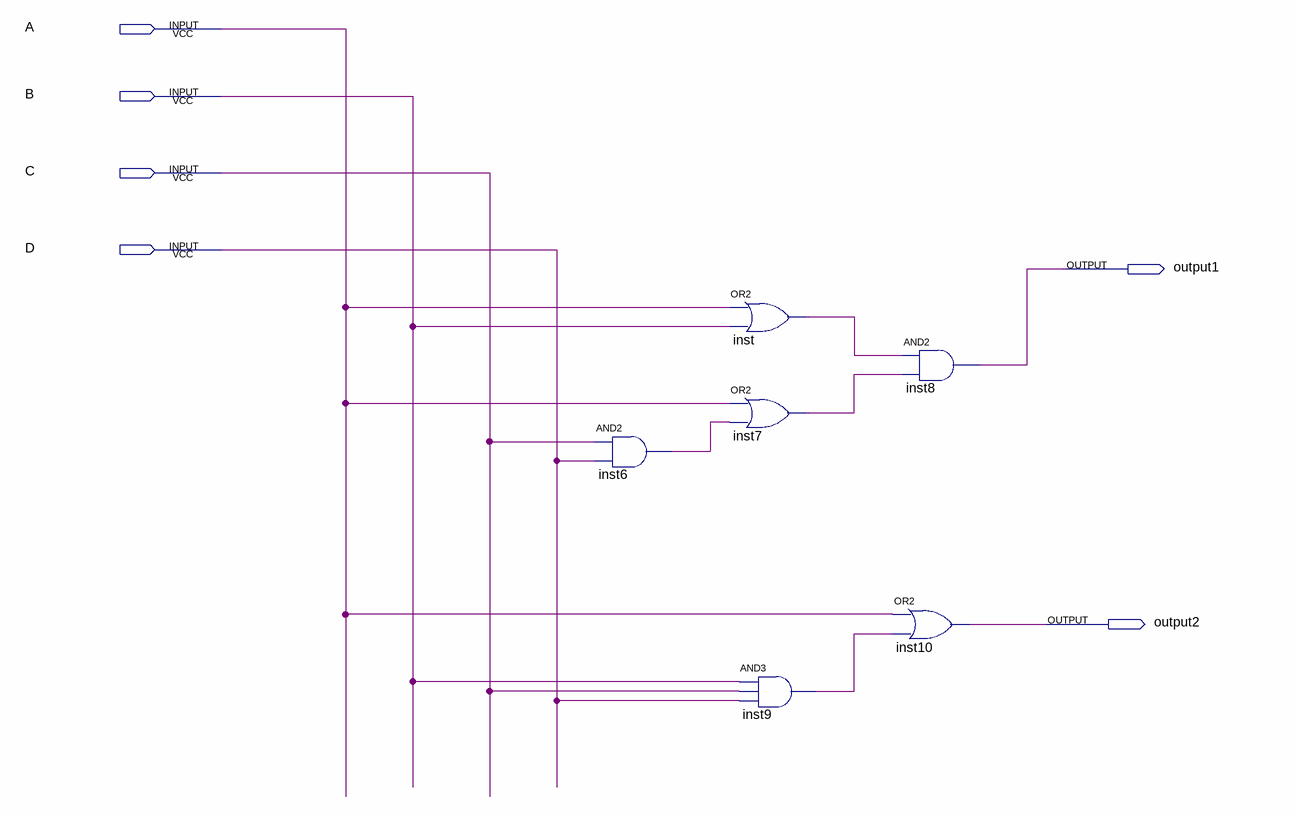
[diagram p0: schematic sheet]
// Quartus schematic work1.bdf as structural Verilog: 6 symbols, 6 pins
module work1 (
  input  A,
  input  B,
  input  C,
  input  D,
  output output1,
  output output2
);

  wire inst6_out, inst7_out, inst9_out, inst_out;

  and inst6 (inst6_out, C, D);
  or inst (inst_out, A, B);
  or inst7 (inst7_out, A, inst6_out);
  and inst9 (inst9_out, B, C, D);
  and inst8 (output1, inst_out, inst7_out);
  or inst10 (output2, A, inst9_out);
endmodule
